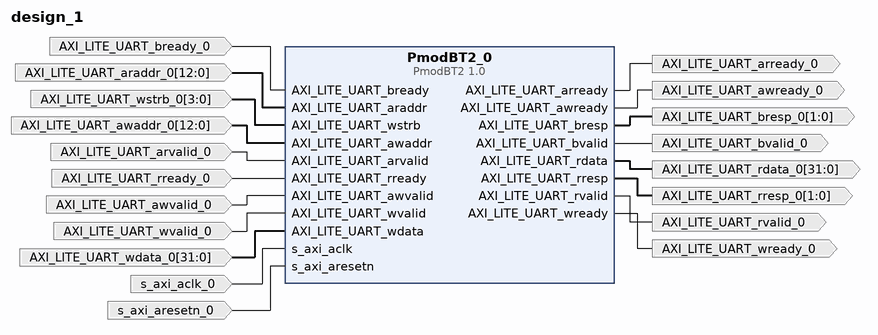
[diagram p0: block diagram of the top level]
# Vivado block design design_1, xc7a35tcpg236-1, Vivado 2017.4.1
create_bd_design design_1

create_bd_port -dir O AXI_LITE_UART_rvalid_0
create_bd_port -dir O -from 1 -to 0 AXI_LITE_UART_bresp_0
create_bd_port -dir I AXI_LITE_UART_bready_0
create_bd_port -dir O AXI_LITE_UART_arready_0
create_bd_port -dir O -from 31 -to 0 AXI_LITE_UART_rdata_0
create_bd_port -dir I -from 12 -to 0 AXI_LITE_UART_araddr_0
create_bd_port -dir O AXI_LITE_UART_bvalid_0
create_bd_port -dir I -from 3 -to 0 AXI_LITE_UART_wstrb_0
create_bd_port -dir I -from 12 -to 0 AXI_LITE_UART_awaddr_0
create_bd_port -dir O AXI_LITE_UART_wready_0
create_bd_port -dir O -from 1 -to 0 AXI_LITE_UART_rresp_0
create_bd_port -dir I AXI_LITE_UART_arvalid_0
create_bd_port -dir I AXI_LITE_UART_rready_0
create_bd_port -dir I AXI_LITE_UART_awvalid_0
create_bd_port -dir I AXI_LITE_UART_wvalid_0
create_bd_port -dir I -from 31 -to 0 AXI_LITE_UART_wdata_0
create_bd_port -dir O AXI_LITE_UART_awready_0
create_bd_port -dir I -type clk s_axi_aclk_0
create_bd_port -dir I -type rst s_axi_aresetn_0

create_bd_cell -type ip -vlnv digilentinc.com:IP:PmodBT2:1.0 PmodBT2_0
set_property -dict {CONFIG.PMOD ja} [get_bd_cells PmodBT2_0]

# ---- connections ----

connect_bd_net [get_bd_pins PmodBT2_0/AXI_LITE_UART_rvalid] [get_bd_ports AXI_LITE_UART_rvalid_0]
connect_bd_net [get_bd_pins PmodBT2_0/AXI_LITE_UART_bresp] [get_bd_ports AXI_LITE_UART_bresp_0]
connect_bd_net -net AXI_LITE_UART_bready_0_1 [get_bd_ports AXI_LITE_UART_bready_0] [get_bd_pins PmodBT2_0/AXI_LITE_UART_bready]
connect_bd_net [get_bd_pins PmodBT2_0/AXI_LITE_UART_arready] [get_bd_ports AXI_LITE_UART_arready_0]
connect_bd_net [get_bd_pins PmodBT2_0/AXI_LITE_UART_rdata] [get_bd_ports AXI_LITE_UART_rdata_0]
connect_bd_net -net AXI_LITE_UART_araddr_0_1 [get_bd_ports AXI_LITE_UART_araddr_0] [get_bd_pins PmodBT2_0/AXI_LITE_UART_araddr]
connect_bd_net [get_bd_pins PmodBT2_0/AXI_LITE_UART_bvalid] [get_bd_ports AXI_LITE_UART_bvalid_0]
connect_bd_net -net AXI_LITE_UART_wstrb_0_1 [get_bd_ports AXI_LITE_UART_wstrb_0] [get_bd_pins PmodBT2_0/AXI_LITE_UART_wstrb]
connect_bd_net -net AXI_LITE_UART_awaddr_0_1 [get_bd_ports AXI_LITE_UART_awaddr_0] [get_bd_pins PmodBT2_0/AXI_LITE_UART_awaddr]
connect_bd_net [get_bd_pins PmodBT2_0/AXI_LITE_UART_wready] [get_bd_ports AXI_LITE_UART_wready_0]
connect_bd_net [get_bd_pins PmodBT2_0/AXI_LITE_UART_rresp] [get_bd_ports AXI_LITE_UART_rresp_0]
connect_bd_net -net AXI_LITE_UART_arvalid_0_1 [get_bd_ports AXI_LITE_UART_arvalid_0] [get_bd_pins PmodBT2_0/AXI_LITE_UART_arvalid]
connect_bd_net -net AXI_LITE_UART_rready_0_1 [get_bd_ports AXI_LITE_UART_rready_0] [get_bd_pins PmodBT2_0/AXI_LITE_UART_rready]
connect_bd_net -net AXI_LITE_UART_awvalid_0_1 [get_bd_ports AXI_LITE_UART_awvalid_0] [get_bd_pins PmodBT2_0/AXI_LITE_UART_awvalid]
connect_bd_net -net AXI_LITE_UART_wvalid_0_1 [get_bd_ports AXI_LITE_UART_wvalid_0] [get_bd_pins PmodBT2_0/AXI_LITE_UART_wvalid]
connect_bd_net -net AXI_LITE_UART_wdata_0_1 [get_bd_ports AXI_LITE_UART_wdata_0] [get_bd_pins PmodBT2_0/AXI_LITE_UART_wdata]
connect_bd_net [get_bd_pins PmodBT2_0/AXI_LITE_UART_awready] [get_bd_ports AXI_LITE_UART_awready_0]
connect_bd_net -net s_axi_aclk_0_1 [get_bd_ports s_axi_aclk_0] [get_bd_pins PmodBT2_0/s_axi_aclk]
connect_bd_net -net s_axi_aresetn_0_1 [get_bd_ports s_axi_aresetn_0] [get_bd_pins PmodBT2_0/s_axi_aresetn]

validate_bd_design
save_bd_design
